# Altium schematic sheet Fuente.SchDoc
size A3; SheetNumber: 1; SheetTotal: 1
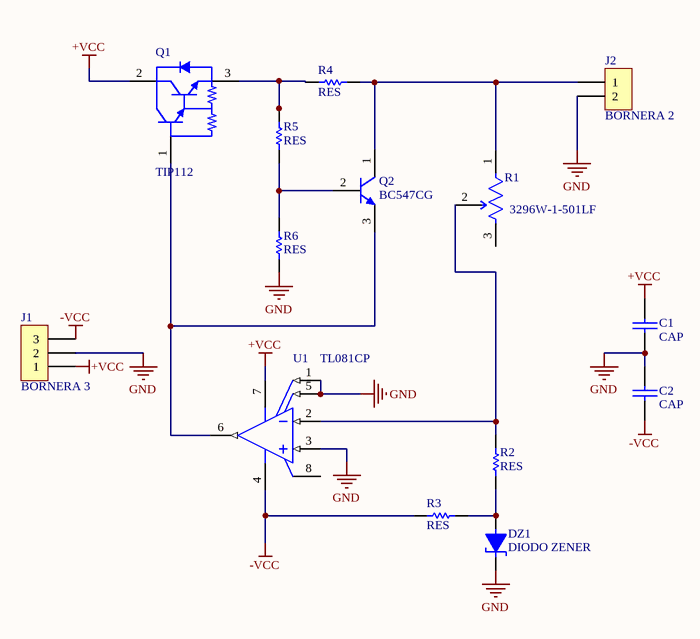
[diagram p0: Fuente.SchDoc]

## Parts
C1  CAP  [CAP200]
C2  CAP  [CAP200]
DZ1  DIODO ZENER  [DO41]
J1  BORNERA 3  [BORNERA3]
J2  BORNERA 2  [BORNERA2]
Q1  TIP112  [ONSC-TO-220-3-221A-09]
Q2  BC547CG  [ONSC-TO-92-3-29-11]
R1  3296W-1-501LF  [FP-3296W-MFG]
R2  RES  [RES400]
R3  RES  [RES400]
R4  RES  [RES600]
R5  RES  [RES400]
R6  RES  [RES400]
U1  TL081CP  [P0008A]

## Nets
+VCC: C1.1 J1.1 Q1.2(C) U1.7(VCC+)
-VCC: C2.2 J1.3 R3.1 U1.4(VCC-)
GND: C1.2 C2.1 DZ1.2 J1.2 J2.2 R6.1 U1.1(OFFSET_N1) U1.3(IN+) U1.5(OFFSET_N2)
NetDZ1_1: DZ1.1 R2.2 R3.2
NetJ2_1: J2.1 Q2.1(C) R1.1(CCW) R4.1
NetQ1_1: Q1.1(B) Q2.3(E) U1.6(OUT)
NetQ1_3: Q1.3(E) R4.2 R5.2
NetQ2_2: Q2.2(B) R5.1 R6.2
NetR1_2: R1.2(WIPER) R2.1 U1.2(IN-)

Not connected (* = marked no-connect by the designer): R1 3(CW); U1 8(NC)

## Library data of the parts
Q1 = CMP-1047-00137-1: Plastic Medium-Power, Complementary Silicon Transistor, 3-Pin TO-220, Tube; Manufacturer: On Semiconductor; IC Continuous (A): 2; Polarity: NPN; ComponentLink2URL: http://www.onsemi.cn/pub_link/Collateral/TIP110-D.PDF; Mounting Technology: Through Hole; DatasheetVersion: Rev. 7; PackageVersion: Rev. AG, 09/2011; Packing: Tube; ComponentLink3URL: http://www.onsemi.com/pub_link/Collateral/221A-09.PDF; RoHS: FALSE; PackageReference: TO-220-3-221A-09; PackageDescription: 3-Pin Flange Mount, Vertical Straight Lead, Body 9.97 x 4.445 mm, Pitch 2.54 mm; ComponentLink3Description: Package Specification; PartNumber: TIP112; ComponentLink1URL: http://www.onsemi.com/; ComponentLink2Description: Datasheet; ComponentLink1Description: Manufacturer URL
Q2 = CMP-1048-01467-1: Amplifier Transistor, NPN Silicon, 3-Pin TO-92, Bulk Box; Manufacturer: On Semiconductor; PartNumber: BC547B; IC Continuous (A): 0.1; fT Min (MHz): 150; DatasheetVersion: Rev. 7; ComponentLink1URL: http://www.onsemi.com/; Polarity: NPN; RoHS: FALSE; ComponentLink1Description: Manufacturer URL; Packing: Bulk Box; PackageDescription: 3-Pin Transistor Outline, Body 4.825 x 3.685 mm, Pitch 1.27 mm; ComponentLink3URL: http://www.onsemi.cn/pub_link/Collateral/2N6426-D.PDF; ComponentLink2Description: Datasheet; PackageVersion: Rev. AM; PackageReference: TO-92-3-29-11_AM_SL; ComponentLink3Description: Package Specification; Mounting Technology: Through Hole; ComponentLink2URL: http://www.onsemi.com/pub_link/Collateral/BC546-D.PDF
R1 = CMP-07234-000046-1: TRIMMER 500 OHM 0.5W PC PIN TOP; Resistance: 500R; Temperature Coefficient: 100ppm/°C; Resistance Tolerance: 10%; Number of Turns: 25; Max Power Dissipation: 500mW; Packaging: Rail/Tube; Color: Blue; Technology: CERMET; Max Operating Temperature: 125°C; RoHS Compliant: Yes; Radiation Hardening: No; Series: 3296; Military Standard: Not; Width: 9.53mm; Weight: 0.03oz; Length: 9.53mm; Package Quantity: 50; Height: 0.395inch; Min Operating Temperature: -55°C; Lead Free: Lead Free; Mount: Through Hole; Depth: 4.83mm; Termination: Pin; Taper: Linear; Contact Plating: Tin; Resistor Type: Cermet; Tolerance: 10%; REACH SVHC: No SVHC; Power Rating: 500mW
U1 = CMP-0017-00937-2: JFET-Input Operational Amplifier, 7 to 36 V, 0 to 70 degC, 8-pin DIP (P8), Pb-Free (RoHS); Manufacturer: Texas Instruments; Rating: Military; GBW(Typ)(MHz): 3; Vio (25C)(Max)(mV): 15; CMRR(Min)(dB): 70; Slew Rate(Typ)(V/us): 13; IIB(Max)(pA): 400; Vn at 1kHz(Typ)(nV/rtHz): 18; Sub Family: General Purpose Amplifier, High Supply Voltage Amplifier (>=30V); Number of Channels: 1; Total Supply Voltage(Min)(+5V is 5, +/-5V is 10): 7; Total Supply Voltage(Max)(+5V is 5, +/-5V is 10): 36; Iq per channel(Max)(mA): 2.8; Eco-Plan: Pb-Free (RoHS); PackageReference: P0008A; ComponentLink3URL: http://www.ti.com/litv/pdf/mpdi001b; ComponentLink1URL: http://www.ti.com/; Mounting Technology: Through Hole; Code_JEDEC: MS-001; ComponentLink3Description: Package Specification; PartNumber: TL081CP; PackageVersion: 4040082/E, 04/2010; ComponentLink2Description: Datasheet; DatasheetVersion: SLOS081G; PackageDescription: 8-Pin Plastic In-Line, Body 9.59 x 6.35 mm, Pitch 2.54 mm; ComponentLink2URL: http://www.ti.com/lit/ds/symlink/tl081.pdf; Offset Drift(Typ)(uV/C): 18; ComponentLink1Description: Manufacturer URL